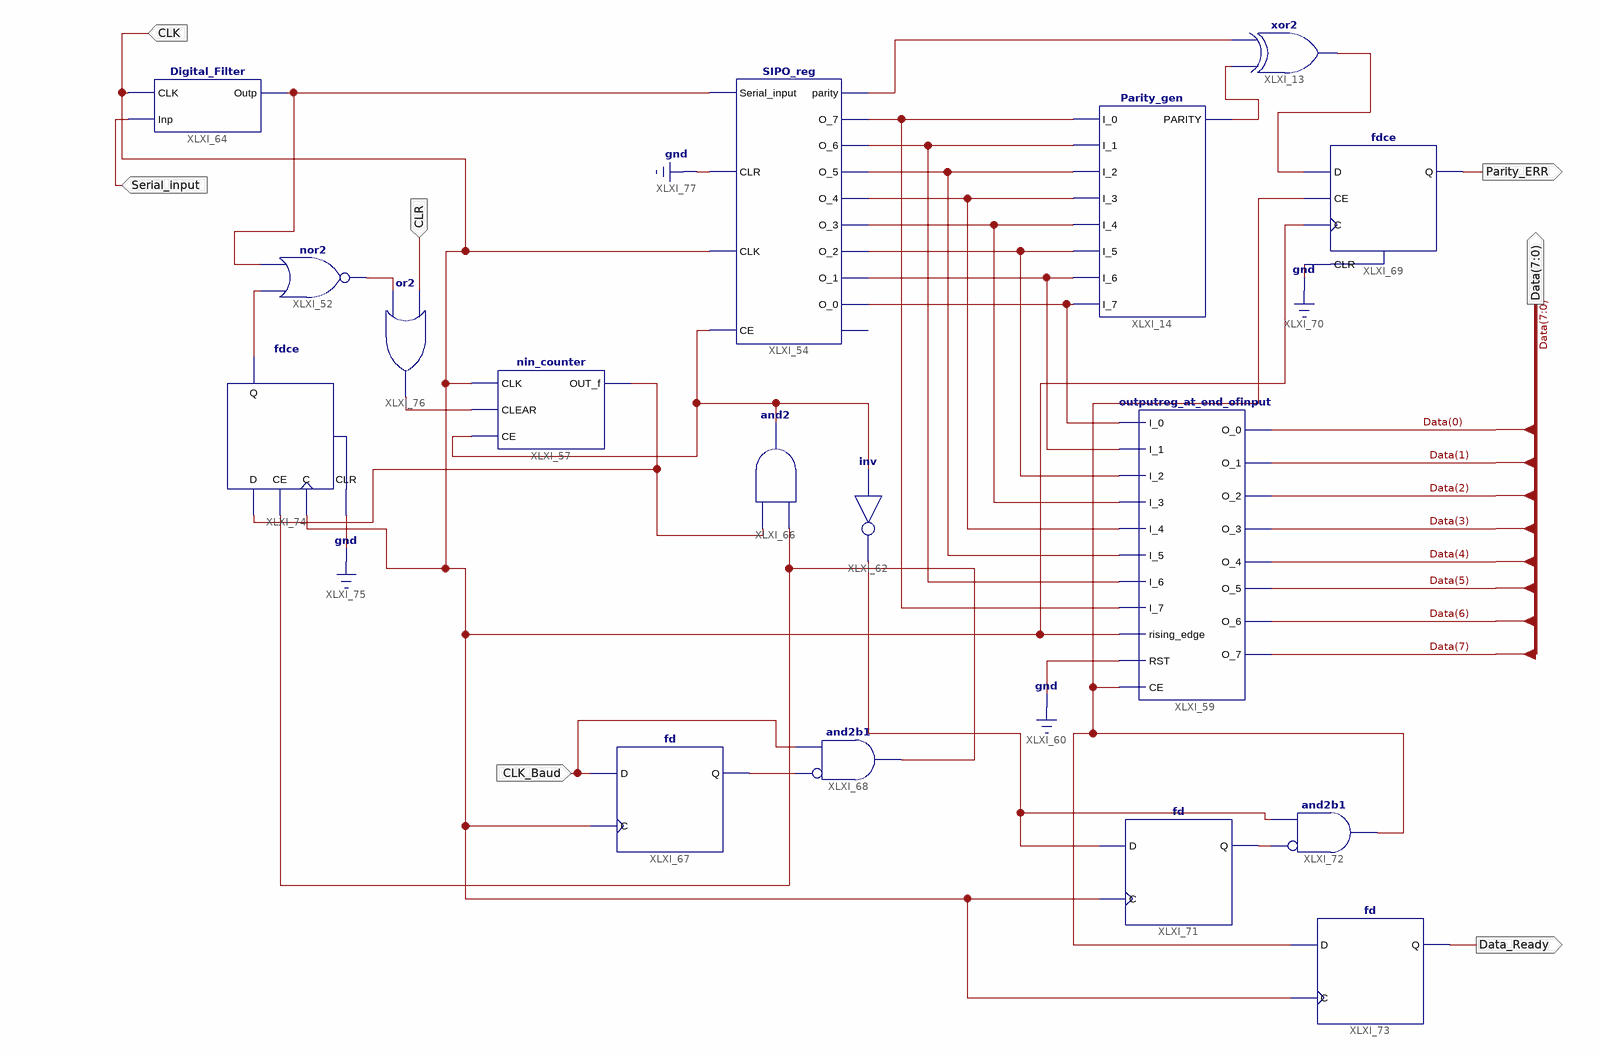
[diagram p0: schematic sheet 1]
// Xilinx ISE schematic usart_receiver.sch (spartan3e) as structural Verilog: 17 symbols, 7 ports
module usart_receiver (
  input  CLK_Baud,
  input  Serial_input,
  input  CLK,
  input  CLR,
  output Parity_ERR,
  output [7:0] Data,
  output Data_Ready
);

  wire Data_Ready_1, dec, par, XLXN_63, XLXN_134, XLXN_135, XLXN_136, XLXN_137, XLXN_138, XLXN_159, XLXN_160,
       XLXN_161, XLXN_165, XLXN_170, XLXN_189, XLXN_190, XLXN_199, XLXN_209, XLXN_222, XLXN_223, XLXN_230,
       XLXN_237;

  xor XLXI_13 (XLXN_170, XLXN_63, par);
  Parity_gen XLXI_14 (
    .I_0(XLXN_138), .I_1(XLXN_137), .I_2(XLXN_136), .I_3(XLXN_135), .I_4(XLXN_134), .I_5(XLXN_161),
    .I_6(XLXN_160), .I_7(XLXN_159), .PARITY(XLXN_63));
  nor XLXI_52 (XLXN_230, XLXN_222, XLXN_165);
  SIPO_reg XLXI_54 (
    .CE(dec), .CLK(CLK), .CLR(1'b0), .Serial_input(XLXN_165), .O_0(XLXN_159), .O_1(XLXN_160), .O_2(XLXN_161),
    .O_3(XLXN_134), .O_4(XLXN_135), .O_5(XLXN_136), .O_6(XLXN_137), .O_7(XLXN_138), .parity(par));  // open: start_bit
  nin_counter XLXI_57 (.CLK(CLK), .CLEAR(XLXN_237), .OUT_f(XLXN_223), .CE(dec));
  not XLXI_62 (Data_Ready_1, dec);
  Digital_Filter XLXI_64 (.CLK(CLK), .Inp(Serial_input), .Outp(XLXN_165));
  and XLXI_66 (dec, XLXN_190, XLXN_223);
  fd XLXI_67 (.C(CLK), .D(CLK_Baud), .Q(XLXN_189));
  and XLXI_68 (XLXN_190, ~XLXN_189, CLK_Baud);  // and2b1
  fdce XLXI_69 (.C(CLK), .CE(XLXN_209), .CLR(1'b0), .D(XLXN_170), .Q(Parity_ERR));
  fd XLXI_71 (.C(CLK), .D(Data_Ready_1), .Q(XLXN_199));
  and XLXI_72 (XLXN_209, ~XLXN_199, Data_Ready_1);  // and2b1
  outputreg_at_end_ofinput XLXI_59 (
    .O_5(Data[5]), .O_6(Data[6]), .O_7(Data[7]), .O_1(Data[1]), .O_2(Data[2]), .O_3(Data[3]), .O_0(Data[0]),
    .O_4(Data[4]), .rising_edge(CLK), .RST(1'b0), .CE(XLXN_209), .I_5(XLXN_136), .I_6(XLXN_137),
    .I_7(XLXN_138), .I_4(XLXN_135), .I_2(XLXN_161), .I_3(XLXN_134), .I_1(XLXN_160), .I_0(XLXN_159));
  fd XLXI_73 (.C(CLK), .D(XLXN_209), .Q(Data_Ready));
  fdce XLXI_74 (.C(CLK), .CE(XLXN_190), .CLR(1'b0), .D(XLXN_223), .Q(XLXN_222));
  or XLXI_76 (XLXN_237, XLXN_230, CLR);
endmodule
